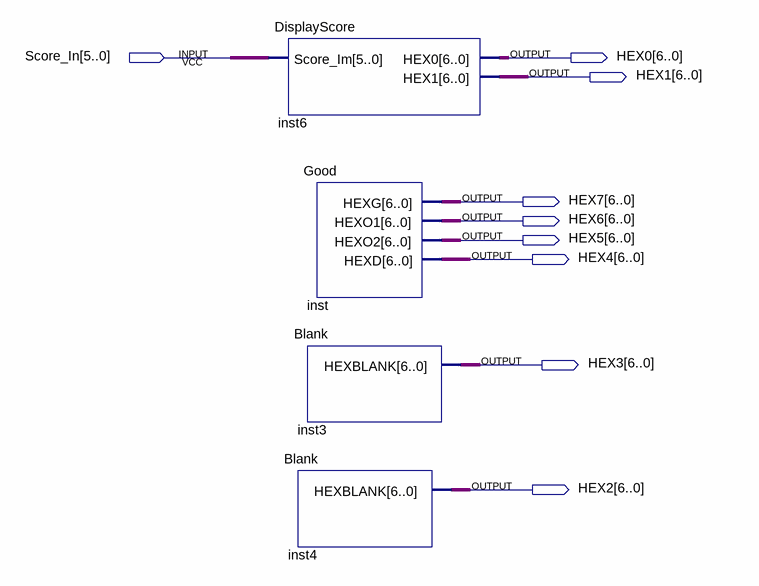
[diagram p0: schematic sheet]
// Quartus schematic GoodDisplay.bdf as structural Verilog: 4 symbols, 9 pins
module GoodDisplay (
  input  [5:0] Score_In,
  output [6:0] HEX0,
  output [6:0] HEX1,
  output [6:0] HEX7,
  output [6:0] HEX6,
  output [6:0] HEX5,
  output [6:0] HEX4,
  output [6:0] HEX3,
  output [6:0] HEX2
);

  DisplayScore inst6 (.Score_Im(Score_In), .HEX0(HEX0), .HEX1(HEX1));
  Good inst (.HEXG(HEX7), .HEXO1(HEX6), .HEXO2(HEX5), .HEXD(HEX4));
  Blank inst3 (.HEXBLANK(HEX3));
  Blank inst4 (.HEXBLANK(HEX2));
endmodule
